# EAGLE design pic_funky (EAGLE 7.5.0)
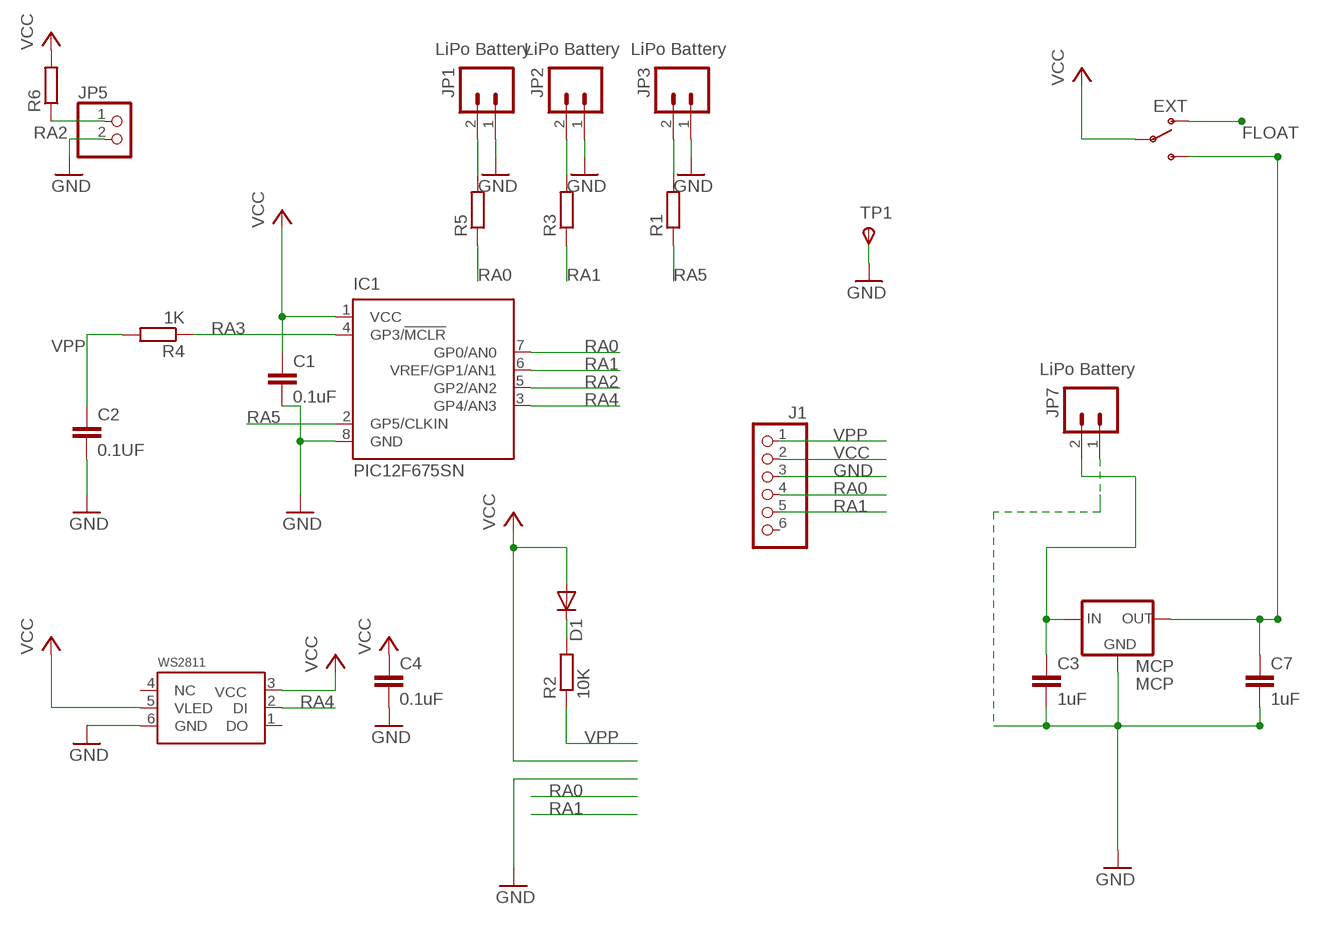
[diagram p0: schematic, sheet 1]

## Parts
C1  0.1uF  C-EUC0805  [C0805]
C2  0.1UF  C-EUC0805  [C0805]
C3  1uF  C-EUC0805  [C0805]
C4  0.1uF  C-EUC0805  [C0805]
C7  1uF  C-EUC0805  [C0805]
D1  1N4148  DIODESOD-323F  [SOD-323F]
IC1  PIC12F675SN  [SO-08]
J1  PH1X650MIL  [PH1X6_50MIL]
JP1  LiPo Battery  M02JST-PTH-2  [JST-2-PTH]
JP2  LiPo Battery  M02JST-PTH-2  [JST-2-PTH]
JP3  LiPo Battery  M02JST-PTH-2  [JST-2-PTH]
JP5  PINHD-1X2  [1X02]
JP7  LiPo Battery  M02JST-PTH-2  [JST-2-PTH]
MCP  MCP  MCP1700SOT-23  [SOT-23]
ON  EXT  SWITCH-SPSTPTH  [SWITCH-SPDT]
R1  R-EU_R0805  [R0805]
R2  10K  R-EU_R0805  [R0805]
R3  R-EU_R0805  [R0805]
R4  1K  R-EU_R0805  [R0805]
R5  R-EU_R0805  [R0805]
R6  R-EU_R0805  [R0805]
TP1  TPSTP20R  [TP20R]
WS2811  5050WS2811W  [RGBLED5050W]

## Nets
FLOAT: ON.1(O)
GND [GND]: C1.2 C2.2 C3.2 C4.2 C7.2 IC1.8(GND) J1.3 JP1.1 JP2.1 JP3.1 JP5.2 JP7.1 MCP.1(GND) TP1.TP(PP) WS2811.6(GND)
N$1: JP1.2 R5.2
N$2: JP2.2 R3.2
N$3: JP3.2 R1.2
N$5: D1.C R2.2
RA0: IC1.7(GP0/AN0) J1.4 R5.1
RA1: IC1.6(VREF/GP1/AN1) J1.5 R3.1
RA2: IC1.5(GP2/AN2) JP5.1 R6.1
RA3: IC1.4(GP3/!MCLR) R4.1
RA4: IC1.3(GP4/AN3) WS2811.2(DI)
RA5: IC1.2(GP5/CLKIN) R1.1
VCC [VCC]: C1.1 C4.1 D1.A IC1.1(VCC) J1.2 ON.2(P) R6.2 WS2811.3(VCC) WS2811.5(VLED)
VCCEXT [VCC]: C3.1 JP7.2 MCP.3(IN)
VCCREG [VCC]: C7.1 MCP.2(OUT) ON.3(S)
VPP: C2.1 J1.1 R2.1 R4.2
Unconnected: J1.6 WS2811.1(DO) WS2811.4(NC)

## Library data of the parts
C1-C4 C7 = resistor:C-EU: CAPACITOR, European symbol
D1 = adafruit:DIODE: Diode SMADIODE - SMA Surface Mount Package 20V 1A Schottky Diode Digikey: 641-1014-6-ND DO-1N4148 - Through Hole Small Current Diode SOD-123 20V 1 A (.5mV Vf) Schottky Diode - Digikey: MBRX120TPMSCT-ND SOD-323 10V 570mA (.38mV Vf, 3ns) Schottky Diode - Digikey: ZLLS410CT-ND SOD-523 30V 30mA Schottky Diode (RB751S-40TE61) - Digikey: RB751S-40TE61CT-ND SOT23-R/W - SOT23 Package (R = Solder Paste/Reflow Ovens, W = Hand-Soldering) BAT54Film 40V 300mA - Digikey: 497-7162-1-ND
IC1 = microchip:PIC12F675: 8-Pin FLASH-Based 8-Bit CMOS Microcontroller Precision Internal 4 MHz oscillator factory calibrated to ±1% Low Power Features: Standby Current: - 1 nA @ 2.0V, typical Operating Current: - 8.5µA @ 32 kHz, 2.0V, typical - 100µA @ 1 MHz, 2.0V, typical Watchdog Timer Current: - 300 nA @ 2.0V, typical Timer1 oscillator current: - 4µA @ 32 kHz, 2.0V, typical Analog-to-Digital Converter module: - 10-bit resolution - Programmable 4-channel input - Voltage reference input Source: http://www.microchip.com .. 41190E.pdf; MF: MICROCHIP; MPN: PIC12F675-E/SN; OC_FARNELL: 9759026; OC_NEWARK: 92C4341
J1 = MY_CONN:PH1X6
JP1-JP3 JP7 = SparkFun:M02: Header 2 Standard 2-pin 0.1" header. Use with straight break away headers (SKU : PRT-00116), right angle break away headers (PRT-00553), swiss pins (PRT-00743), machine pins (PRT-00117), and female headers (PRT-00115). Molex polarized connector foot print use with SKU : PRT-08233 with associated crimp pins and housings.
JP5 = pinhead:PINHD-1X2: PIN HEADER
MCP = MY_IC:MCP1700
ON = SparkFun:SWITCH-SPST: SPST Switch Simple slide switch. Spark Fun Electronics SKU : COM-00102
R1-R6 = resistor:R-EU_: RESISTOR, European symbol
TP1 = testpad:TPS: TEST PIN
WS2811 = 5050WS2811:5050WS2811

## Net classes
0 default: width 0.016 mm
1 GND: width 0.025 mm, drill 0.508 mm, clearance 0.254 mm
2 VCC: width 0.025 mm, drill 0.508 mm, clearance 0.254 mm

## Board
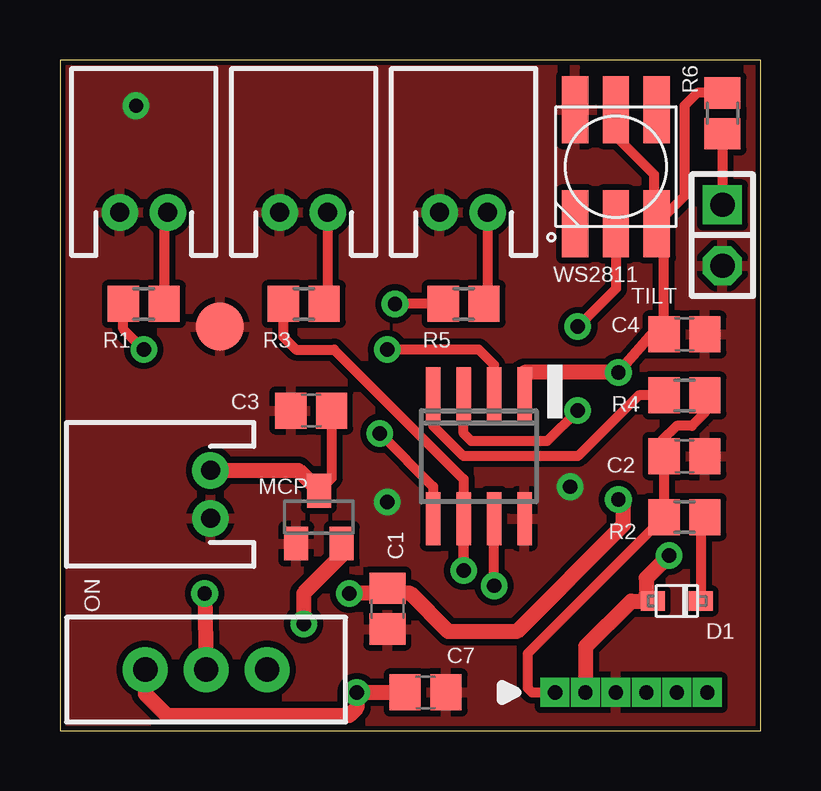
[diagram p1: board, top side]
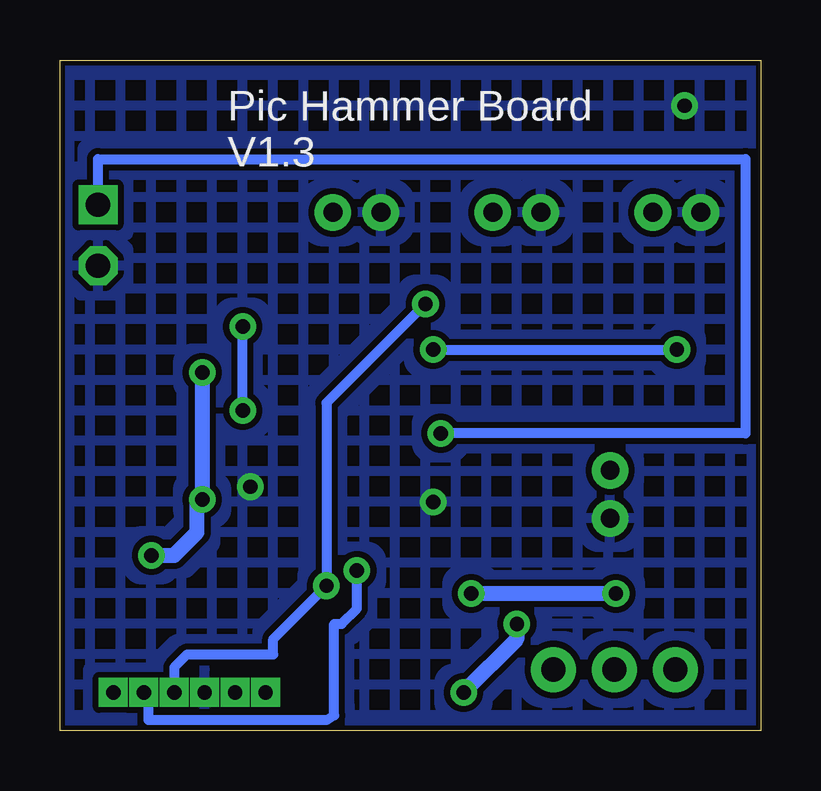
[diagram p2: board, bottom side, seen from below]

Size 29.21 x 27.94 mm. Coordinates in mm from the lower left corner, seen from the top.
Outline: 0,0 29.21,0 29.21,27.94 0,27.94 0,0
Copper layers (1*16): Top 0.035mm / dielectric 1.5mm / Bottom 0.035mm
Design rules "SparkFun *": minimum track width 20mil, minimum drill 20mil, track to track 8mil, track to pad 8mil, pad to pad 8mil, via to via 8mil, smd to smd 8mil, copper to edge 8mil, drill to drill 8mil, minimum pad ring 12mil, minimum via ring 10mil, stop-mask expansion 4mil, vias tented up to drill 25mil, thermal gap 10mil

### Footprints (pad centres in the part's own frame; a part is rotated, then mirrored left to right if it is on the bottom)
C0805 = smd 1.3 x 1.5: 1 -0.85,0; 2 0.85,0
SOD-323F = smd 1 x 0.8: A -1,0; C 1,0
SO-08 = smd 0.6 x 2.2: 1 -1.905,-2.6; 2 -0.635,-2.6; 3 0.635,-2.6; 4 1.905,-2.6; 5 1.905,2.6; 6 0.635,2.6; 7 -0.635,2.6; 8 -1.905,2.6
PH1X6_50MIL = drill 0.6 pad 0.889 square: 1 0,0; 2 0,-1.27; 3 0,-2.54; 4 0,-3.81; 5 0,-5.08; 6 0,-6.35
JST-2-PTH = drill 0.787 pad 1.524: 1 -1,0; 2 1,0
1X02 = drill 1.016 square: 1 -1.27,0 | drill 1.016 octagon: 2 1.27,0
SOT-23 = smd 1 x 1.4: 1 -0.95,-1.1; 2 0.95,-1.1; 3 0,1.1
SWITCH-SPDT = drill 1.016 pad 1.88: 1 0,2.54; 2 0,0; 3 0,-2.54
R0805 = smd 1.3 x 1.5: 1 -0.85,0; 2 0.85,0
TP20R = smd 2 x 2: TP 0,0
RGBLED5050W = smd 2.794 x 1.1: 1 -2.381,1.7; 2 -2.381,0; 3 -2.381,-1.7; 4 2.381,-1.7; 5 2.381,0; 6 2.381,1.7

### Placement (x,y rotation side)
C1  13.65,5.08 270 top
C2  26.04,11.43 0 top
C3  10.48,13.34 180 top
C4  26.04,16.51 0 top
C7  15.24,1.59 0 top
D1  25.72,5.4 0 top
IC1  17.46,11.43 180 top
J1  20.64,1.59 90 top
JP1  16.83,21.59 0 top
JP2  10.16,21.59 0 top
JP3  3.49,21.59 0 top
JP5  27.62,20.64 270 top
JP7  6.27,9.84 90 top
MCP  10.79,8.89 0 top
ON  6.1,2.54 270 top
R1  3.49,17.78 0 top
R2  26.04,8.89 0 top
R3  10.16,17.78 0 top
R4  26.04,13.97 0 top
R5  16.83,17.78 0 top
R6  27.62,25.72 90 top
TP1  6.67,16.83 0 top
WS2811  23.18,23.5 90 top

### Tracks (layer width: path | path; a pad name or v marks a point on that pad's centre or on a via)
GND  (via drill 0.6)
  other vias: 21.27,10.16 13.65,9.53 3.18,26.04
  pour Top: -0.64,28.58 29.53,28.58 29.21,-0.64 -0.64,-0.64
  pour Bottom (hatched): -0.64,28.58 29.53,28.58 29.21,-0.64 -0.64,-0.64
N$1
  Top 0.406: JP1.2 17.83,17.93 R5.2
N$2
  Top 0.406: JP2.2 11.16,17.93 R3.2
N$3
  Top 0.406: JP3.2 4.34,21.59 R1.2
N$5
  Top 0.406: R2.2 26.72,9.04 D1.C
RA0  (via drill 0.6)
  Top 0.406: R5.1 v13.97,17.78 | v18.1,6.03 IC1.7
  Bottom 0.406: v13.97,17.78 18.1,13.65 v18.1,6.03 20.32,3.81 20.32,3.17 23.91,3.17 24.45,2.63 J1.4
RA1  (via drill 0.6)
  Top 0.406: R3.1 9.31,16.41 9.84,15.88 11.43,15.88 16.83,10.48 v16.83,6.67 IC1.6
  Bottom 0.406: v16.83,6.67 16.83,5.08 17.46,4.45 17.78,4.45 17.78,0.63 18.1,0.43 25.51,0.43 25.51,1.38 J1.5
RA2  (via drill 0.6)
  Top 0.406: R6.1 JP5.1 | v13.33,12.38 15.56,10.16 IC1.5 15.56,8.25
  Bottom 0.406: JP5.1 27.62,23.81 0.64,23.81 0.64,12.38 v13.33,12.38
RA3
  Top 0.406: R4.1 24.13,13.97 21.59,11.43 16.83,11.43 15.56,12.7 IC1.4
RA4  (via drill 0.6)
  Top 0.406: v21.59,13.34 20.32,12.07 17.14,12.07 16.83,12.38 IC1.3 | 21.91,16.83 v21.59,16.83 23.18,18.41 WS2811.2
  Bottom 0.406: v21.59,13.34 v21.59,16.83
RA5  (via drill 0.6)
  Top 0.406: IC1.2 18.1,15.24 17.46,15.88 v13.65,15.88 | v3.49,15.88 2.64,16.73 R1.1
  Bottom 0.406: v13.65,15.88 v3.49,15.88
VCC  (via drill 0.6)
  Top 0.406: 19.37,14.92 IC1.1 | R6.2 26.57,26.57 26.04,26.04 26.04,22.27 WS2811.3 | WS2811.5 23.18,24.77 24.77,23.18 24.77,21.54 WS2811.3 | WS2811.3 25.19,21.12 C4.1 24.77,16.61 v23.28,14.92
  Top 0.635: v12.06,5.71 13.44,5.71 C1.1 13.87,5.71 14.6,5.71 16.19,4.13 19.05,4.13 23.5,8.57 23.5,9.41 v23.28,9.63 | v6.03,5.71 6.1,2.6 ON.2 | v23.28,14.92 19.37,14.92 | v25.4,7.3 24.45,6.35 24.45,5.67 D1.A 23.81,5.4 21.91,3.49 J1.2
  Bottom 0.635: v12.06,5.71 v6.03,5.71 | v23.28,14.92 v23.28,9.63 23.5,9.41 23.5,8.25 24.45,7.3 v25.4,7.3
VCCEXT
  Top 0.406: C3.1 11.33,10.52 MCP.3
  Top 0.635: JP7.2 9.94,10.84 MCP.3
VCCREG  (via drill 0.6)
  Top 0.635: MCP.2 11.74,7.3 10.16,5.71 v10.16,4.45 | C7.1 v12.38,1.59 12.38,0.95 12.06,0.63 4.45,0.63 3.56,1.52 ON.3
  Bottom 0.635: v10.16,4.45 10.16,3.81 v12.38,1.59
VPP
  Top 0.406: R4.2 26.89,13.23 26.35,12.7 25.72,12.7 25.08,12.07 25.08,11.53 C2.1 R2.1 19.5,3.2 19.5,1.78 19.69,1.59 J1.1

### Text on the board
tNames: TILT
bNames: Pic Hammer Board / V1.3